# Altium project PMP1.PrjPcb
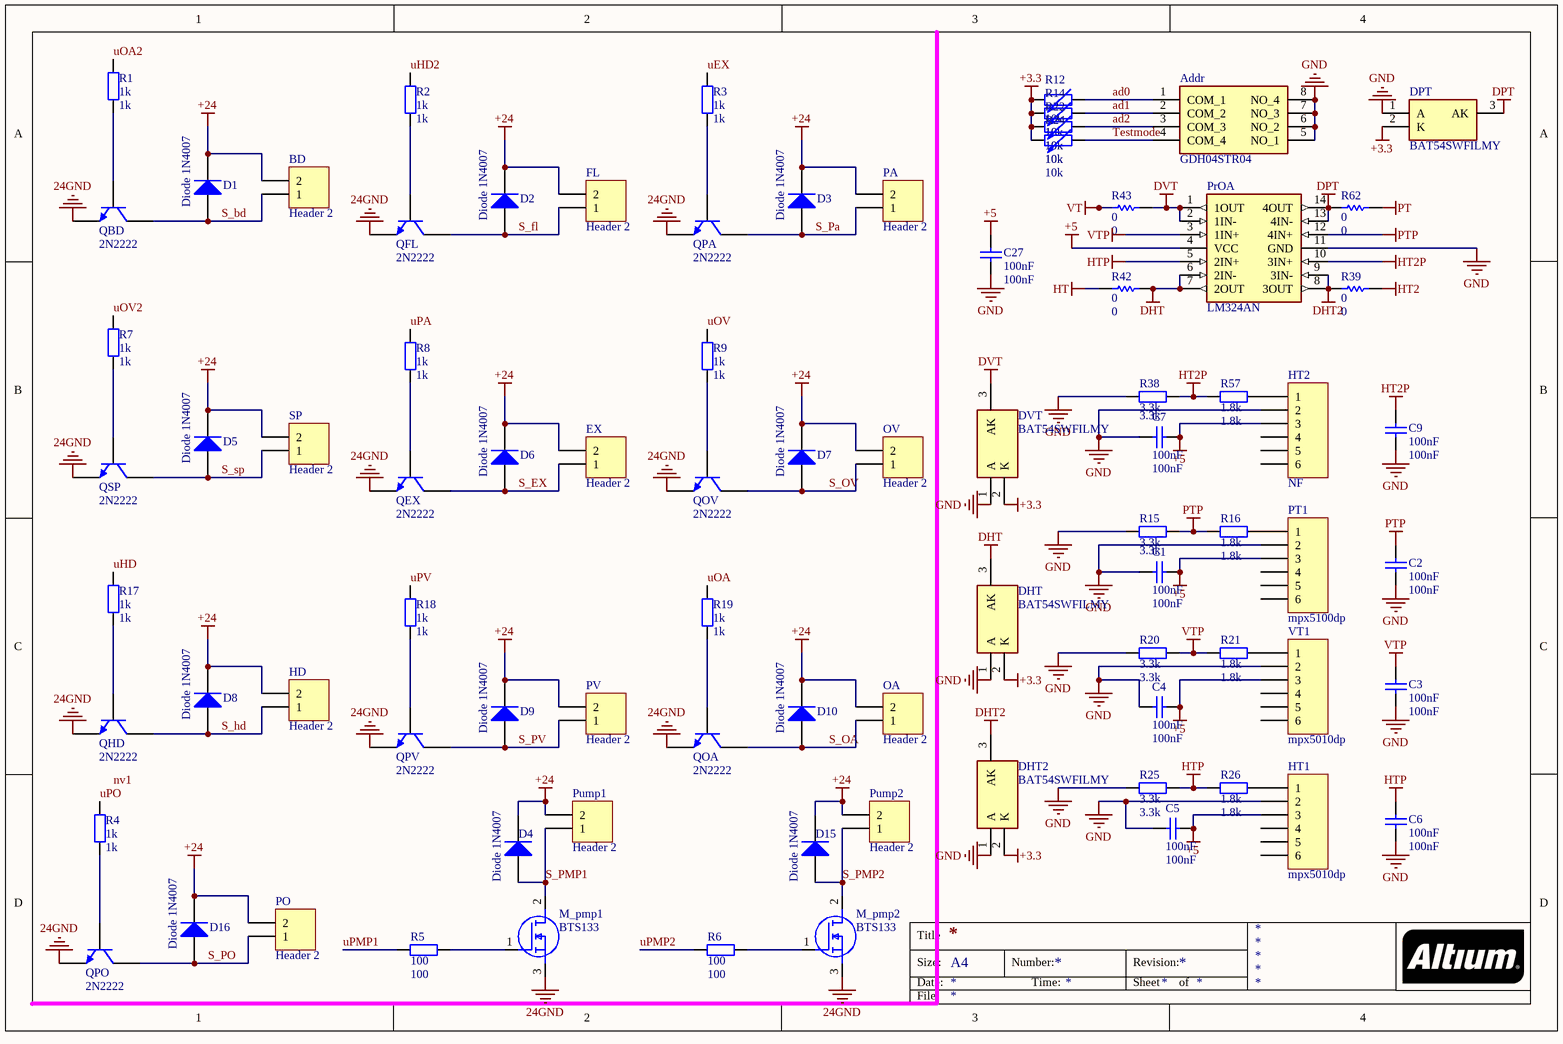
[diagram p0: accessories.SchDoc]
5 sheets, 198 parts. Net scope: global (net labels, ports and power ports of the same name join across sheets).
Board file: PMP.PcbDoc
Sheets:
  accessories.SchDoc
  Power.SchDoc
  microf4.SchDoc
  CAN bus.SchDoc
  gatedriver.SchDoc

## Sheet accessories.SchDoc
size A4

### Parts
Addr  GDH04STR04  [GDH04STR04]
BD  Header 2  [PHOENIX2-Right]
C1  100nF  [0805]
C2  100nF  [0805]
C3  100nF  [0805]
C4  100nF  [0805]
C5  100nF  [0805]
C6  100nF  [0805]
C7  100nF  [0805]
C9  100nF  [0805]
C27  100nF  [0805]
D1  Diode 1N4007  [DO-41]
D2  Diode 1N4007  [DO-41]
D3  Diode 1N4007  [DO-41]
D4  Diode 1N4007  [DO-41]
D5  Diode 1N4007  [DO-41]
D6  Diode 1N4007  [DO-41]
D7  Diode 1N4007  [DO-41]
D8  Diode 1N4007  [DO-41]
D9  Diode 1N4007  [DO-41]
D10  Diode 1N4007  [DO-41]
D15  Diode 1N4007  [DO-41]
D16  Diode 1N4007  [DO-41]
DHT  BAT54SWFILMY  [psm712]
DHT2  BAT54SWFILMY  [psm712]
DPT  BAT54SWFILMY  [psm712]
DVT  BAT54SWFILMY  [psm712]
EX  Header 2  [PHOENIX2-Right]
FL  Header 2  [PHOENIX2-Right]
HD  Header 2  [PHOENIX2-Right]
HT1  mpx5010dp  [mpx-dp]
HT2  NF  [mpx-dp]
M_pmp1  BTS133  [IPB026N06NATMA1]
M_pmp2  BTS133  [IPB026N06NATMA1]
OA  Header 2  [PHOENIX2-Right]
OV  Header 2  [PHOENIX2-Right]
PA  Header 2  [PHOENIX2-Right]
PO  Header 2  [PHOENIX2-right]
PrOA  LM324AN  [DIP254P762X432-14]
PT1  mpx5100dp  [mpx-dp]
Pump1  Header 2  [PHOENIX2-Right]
Pump2  Header 2  [PHOENIX2-Right]
PV  Header 2  [PHOENIX2-Right]
QBD  2N2222  [2n2222]
QEX  2N2222  [2n2222]
QFL  2N2222  [2n2222]
QHD  2N2222  [2n2222]
QOA  2N2222  [2n2222]
QOV  2N2222  [2n2222]
QPA  2N2222  [2n2222]
QPO  2N2222  [2n2222]
QPV  2N2222  [2n2222]
QSP  2N2222  [2n2222]
R1  1k  [0805]
R2  1k  [0805]
R3  1k  [0805]
R4  1k  [0805]
R5  100  [0805]
R6  100  [0805]
R7  1k  [0805]
R8  1k  [0805]
R9  1k  [0805]
R12  10k  [0805]
R14  10k  [0805]
R15  3.3k  [0805]
R16  1.8k  [0805]
R17  1k  [0805]
R18  1k  [0805]
R19  1k  [0805]
R20  3.3k  [0805]
R21  1.8k  [0805]
R22  10k  [0805]
R24  10k  [0805]
R25  3.3k  [0805]
R26  1.8k  [0805]
R38  3.3k  [0805]
R39  0  [0805]
R42  0  [0805]
R43  0  [0805]
R57  1.8k  [0805]
R62  0  [0805]
SP  Header 2  [PHOENIX2-Right]
VT1  mpx5010dp  [mpx-dp]

### Nets
24GND: M_pmp1.3(S) M_pmp2.3(S) QBD.1(E) QEX.1(E) QFL.1(E) QHD.1(E) QOA.1(E) QOV.1(E) QPA.1(E) QPO.1(E) QPV.1(E) QSP.1(E)
+3.3: DHT.2(K) DHT2.2(K) DPT.2(K) DVT.2(K) R12.2 R14.2 R22.2 R24.2
+5: C1.1 C4.1 C5.1 C7.1 C27.2 HT1.3 HT2.3 PrOA.4(VCC) PT1.3 VT1.3
+24: BD.2 D1.2(K) D2.2(K) D3.2(K) D4.2(K) D5.2(K) D6.2(K) D7.2(K) D8.2(K) D9.2(K) D10.2(K) D15.2(K) D16.2(K) EX.2 FL.2 HD.2 OA.2 OV.2 PA.2 PO.2 Pump1.2 Pump2.2 PV.2 SP.2
DHT: DHT.3(AK) PrOA.6(2IN-) PrOA.7(2OUT) R42.1
DHT2: DHT2.3(AK) PrOA.8(3OUT) PrOA.9(3IN-) R39.1
DPT: DPT.3(AK) PrOA.13(4IN-) PrOA.14(4OUT) R62.1
DVT: DVT.3(AK) PrOA.1(1OUT) PrOA.2(1IN-) R43.2
GND: Addr.5(NO_1) Addr.6(NO_2) Addr.7(NO_3) Addr.8(NO_4) C1.2 C2.2 C3.2 C4.2 C5.2 C6.2 C7.2 C9.2 C27.1 DHT.1(A) DHT2.1(A) DPT.1(A) DVT.1(A) HT1.2 HT2.2 PrOA.11(GND) PT1.2 R15.1 R20.1 R25.1 R38.1 VT1.2  [project net 5GND]
HT: R42.2
HT2: R39.2
HT2P: C9.1 PrOA.10(3IN+) R38.2 R57.1
HTP: C6.1 PrOA.5(2IN+) R25.2 R26.1
PT: R62.2
PTP: C2.1 PrOA.12(4IN+) R15.2 R16.1
VT: R43.1
VTP: C3.1 PrOA.3(1IN+) R20.2 R21.1
ad0: Addr.1(COM_1) R12.1
ad1: Addr.2(COM_2) R14.1
ad2: Addr.3(COM_3) R22.1
S_bd: BD.1 D1.1(A) QBD.3(C)
S_EX: D6.1(A) EX.1 QEX.3(C)
S_fl: D2.1(A) FL.1 QFL.3(C)
S_hd: D8.1(A) HD.1 QHD.3(C)
S_OA: D10.1(A) OA.1 QOA.3(C)
S_OV: D7.1(A) OV.1 QOV.3(C)
S_Pa: D3.1(A) PA.1 QPA.3(C)
S_PMP1: D4.1(A) M_pmp1.2(D) Pump1.1
S_PMP2: D15.1(A) M_pmp2.2(D) Pump2.1
S_PO: D16.1(A) PO.1 QPO.3(C)
S_PV: D9.1(A) PV.1 QPV.3(C)
S_sp: D5.1(A) QSP.3(C) SP.1
Testmode: Addr.4(COM_4) R24.1
uEX: R3.1
uHD: R17.1
uHD2: R2.1
uOA: R19.1
uOA2: R1.1
uOV: R9.1
uOV2: R7.1
uPA: R8.1
uPMP1: R5.1
uPMP2: R6.1
uPO: R4.1
uPV: R18.1
NetHT1_1: HT1.1 R26.2
NetHT2_1: HT2.1 R57.2
NetM_pmp1_1: M_pmp1.1(G) R5.2
NetM_pmp2_1: M_pmp2.1(G) R6.2
NetPT1_1: PT1.1 R16.2
NetQBD_2: QBD.2(B) R1.2
NetQEX_2: QEX.2(B) R8.2
NetQFL_2: QFL.2(B) R2.2
NetQHD_2: QHD.2(B) R17.2
NetQOA_2: QOA.2(B) R19.2
NetQOV_2: QOV.2(B) R9.2
NetQPA_2: QPA.2(B) R3.2
NetQPO_2: QPO.2(B) R4.2
NetQPV_2: QPV.2(B) R18.2
NetQSP_2: QSP.2(B) R7.2
NetR21_2: R21.2 VT1.1

Not connected (* = marked no-connect by the designer): HT1 4 5 6; HT2 4 5 6; PT1 4 5 6; VT1 4 5 6

### Notes on the sheet
- Labels drawn without touching a wire or pin: nv1
- Title
- Size:
- Date:
- A4
- Number:
- Time:
- Revision:
- Sheet
- of
- File:

### Library data of the parts
Addr = GDH04STR04: Switch; Manufacturer_Name: TE Connectivity; Datasheet Link: https://www.te.com/commerce/DocumentDelivery/DDEController?Action=showdoc&DocId=Customer+Drawing%7F1571983%7FC6%7Fpdf%7FEnglish%7FENG_CD_1571983_C6.pdf%7F1571983-5; Height: 2.31mm; Manufacturer_Part_Number: GDH04STR04; Mouser Part Number: 506-GDH04STR04; Mouser Price/Stock: https://www.mouser.co.uk/ProductDetail/TE-Connectivity-Alcoswitch/GDH04STR04?qs=k5V78Jg%2Feq61xymfueD9KA%3D%3D; Arrow Part Number: GDH04STR04; Arrow Price/Stock: https://www.arrow.com/en/products/gdh04str04/te-connectivity?region=nac
BD EX FL HD OA OV PA PO Pump1 Pump2 PV SP = Header 2: Header, 2-Pin; LatestRevisionDate: 17-Jul-2002; LatestRevisionNote: Re-released for DXP Platform.; Publisher: Altium Limited
C1-C7 C9 = Cap: Capacitor; Published: 8-Jun-2000; LatestRevisionDate: 17-Jul-2002; LatestRevisionNote: Re-released for DXP Platform.; PackageReference: RAD-0.3; Publisher: Altium Limited; PackageDescription: Radial Cap, Thru-Hole; 2 Leads; 0.3 in Pin Spacing; Value: 100nF
C27 = Cap: Capacitor; Manufacturer: Generic Components; Class: Passive; Published: 08/06/2000; Publisher: Altium Hobart Technology Centre; SubClass: Capacitor; Value: 100nF
D1-D10 D15 D16 = Diode 1N4007: 1 Amp General Purpose Rectifier; Published: 8-Jun-2000; LatestRevisionDate: 17-Jul-2002; LatestRevisionNote: Re-released for DXP Platform.; DatasheetVersion: 1998; PackageVersion: Aug-1999; PackageReference: DO-41; Publisher: Altium Limited; PackageDescription: Diode, Axial; Body 5.2 x 2.7 mm (LxDia. max), Lead Dia. 0.86 mm (max); Code_JEDEC: DO-204-AL; ComponentLink1Description: Manufacturer Link; ComponentLink1URL: http://www.fairchildsemi.com/; ComponentLink2Description: Datasheet; ComponentLink2URL: http://www.fairchildsemi.com/ds/1N%2F1N4001.pdf
DHT DHT2 DPT DVT = BAT54SWFILMY: Schottky Diode; Manufacturer_Name: STMicroelectronics; Datasheet Link: https://www.st.com/resource/en/datasheet/cd00001322.pdf; Height: 1.1mm; Manufacturer_Part_Number: BAT54SWFILMY; Mouser Part Number: 511-BAT54SWFILMY; Mouser Price/Stock: https://www.mouser.co.uk/ProductDetail/STMicroelectronics/BAT54SWFILMY?qs=j%252B1pi9TdxUbxN4fraErVag%3D%3D; Arrow Part Number: BAT54SWFILMY; Arrow Price/Stock: https://www.arrow.com/en/products/bat54swfilmy/stmicroelectronics?region=europe
HT1 HT2 PT1 VT1 = Header 6: Header, 6-Pin; LatestRevisionDate: 17-Jul-2002; LatestRevisionNote: Re-released for DXP Platform.; Publisher: Altium Limited
M_pmp1 M_pmp2 = IPB026N06NATMA1: MOSFET (N-Channel); Manufacturer_Name: Infineon; Datasheet Link: https://www.infineon.com/dgdl/IPB026N06N_Rev2.0.pdf?folderId=db3a304313b8b5a60113cee8763b02d7&fileId=db3a3043372d5cc8013754c7b2a74f7c; Height: 4.82mm; Manufacturer_Part_Number: IPB026N06NATMA1; Mouser Part Number: 726-IPB026N06NATMA1; Mouser Price/Stock: https://www.mouser.co.uk/ProductDetail/Infineon-Technologies/IPB026N06NATMA1?qs=4MqXaUMeF56mbQMXMhITXA%3D%3D; Arrow Part Number: IPB026N06NATMA1; Arrow Price/Stock: https://www.arrow.com/en/products/ipb026n06natma1/infineon-technologies-ag
PrOA = LM324AN: Integrated Circuit; Manufacturer_Name: Texas Instruments; Datasheet Link: http://www.ti.com/lit/ds/symlink/lm324a.pdf; Height: 5.08mm; Manufacturer_Part_Number: LM324AN; Mouser Part Number: 595-LM324AN; Mouser Price/Stock: https://www.mouser.com/Search/Refine.aspx?Keyword=595-LM324AN; RS Part Number: 0527732; RS Price/Stock: http://uk.rs-online.com/web/p/products/0527732
QBD QEX QFL QHD QOA QOV QPA QPO QPV QSP = 2N3904: NPN General Purpose Amplifier; Published: 8-Jun-2000; LatestRevisionDate: 15-Jan-2003; LatestRevisionNote: PCB Footprint 'BCY-W3/D4.7' replaced; DatasheetVersion: 1997; PackageVersion: Sep-1998; PackageReference: TO-92A; Publisher: Altium Limited; PackageDescription: TO, Flat Index; 3 In-Line, Axial Leads; Body Dia. 4.5mm; Leads 0.51 x 0.48 mm (max); ComponentLink1Description: Manufacturer Link; ComponentLink1URL: http://www.fairchildsemi.com/; ComponentLink2Description: Datasheet; ComponentLink2URL: http://www.fairchildsemi.com/ds/2N%2F2N3904.pdf
R1-R9 R15-R21 R25 R26 R38 R57 = Res2: Resistor; Published: 8-Jun-2000; LatestRevisionDate: 17-Jul-2002; LatestRevisionNote: Re-released for DXP Platform.; PackageReference: AXIAL-0.4; Publisher: Altium Limited; PackageDescription: Axial Device, Thru-Hole; 2 Leads; 0.4 in Pin Spacing
  R1-R4 R7-R9 R17-R19: Value: 1k
  R5 R6: Value: 100
  R15 R20 R25 R38: Value: 3.3k
  R16 R21 R26 R57: Value: 1.8k
R12 R14 R22 R24 = Res Adj2: Variable Resistor; Set Position: 0.5; Published: 8-Jun-2000; LatestRevisionDate: 17-Jul-2002; LatestRevisionNote: Re-released for DXP Platform.; PackageReference: AXIAL-0.6; Publisher: Altium Limited; PackageDescription: Axial Device, Thru-Hole; 2 Leads; 0.6 in Pin Spacing; Value: 10k
R39 R42 R43 R62 = Res1: Resistor; Published: 8-Jun-2000; LatestRevisionDate: 17-Jul-2002; LatestRevisionNote: Re-released for DXP Platform.; PackageReference: AXIAL-0.3; Publisher: Altium Limited; Value: 0

## Sheet Power.SchDoc
size A4
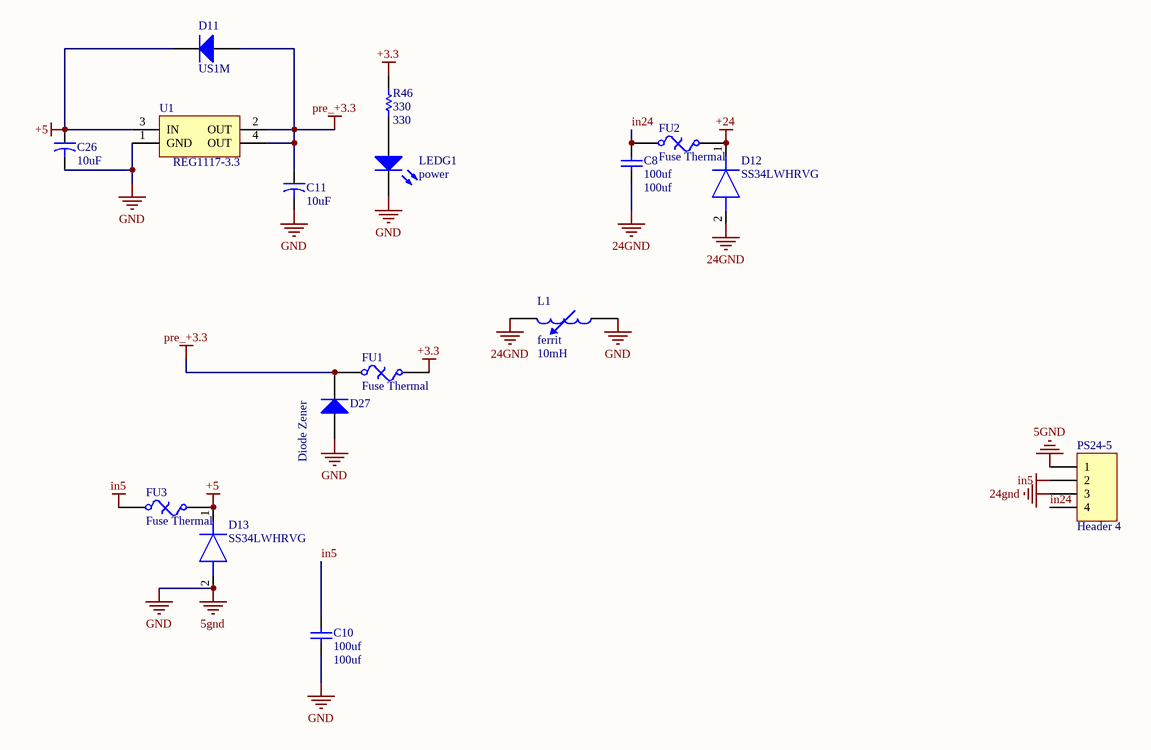
[diagram p1: Power.SchDoc]

### Parts
C8  100uf  [HDR1X2]
C10  100uf  [HDR1X2]
C11  10uF  [0805]
C26  10uF  [0805]
D11  US1M  [US1M]
D12  SS34LWHRVG  [SS34]
D13  SS34LWHRVG  [SS34]
D27  Diode Zener  [d1805]
FU1  Fuse Thermal  [1206]
FU2  Fuse Thermal  [resetable fuse 3A]
FU3  Fuse Thermal  [1206]
L1  ferrit  value 10mH  [fBEAD]
LEDG1  power  [3518]
PS24-5  Header 4  [phoenix4-right]
R46  330  [0805]
U1  REG1117-3.3  [SOT223]

### Nets
5GND: C10.1 C11.2 C26.2 D13.2(A) D27.1(A) L1.1 LEDG1.2(K) PS24-5.1 U1.1(GND)  [also labelled GND]
24GND: C8.1 D12.2(A) L1.2 PS24-5.3
+3.3: FU1.2 R46.1
+5: C26.1 D11.2(K) D13.1(K) FU3.2 U1.3(IN)
+24: D12.1(K) FU2.2
in5: C10.2 FU3.1 PS24-5.2
pre_+3.3: C11.1 D11.1(A) D27.2(K) FU1.1 U1.2(OUT) U1.4(OUT)
in24: C8.2 FU2.1 PS24-5.4
NetLEDG1_1: LEDG1.1(A) R46.2

### Library data of the parts
C8 C10 = Cap: Capacitor; Published: 8-Jun-2000; LatestRevisionDate: 17-Jul-2002; LatestRevisionNote: Re-released for DXP Platform.; PackageReference: RAD-0.3; Publisher: Altium Limited; PackageDescription: Radial Cap, Thru-Hole; 2 Leads; 0.3 in Pin Spacing; Value: 100uf
C11 C26 = Cap_El: Capacitor; Published: 23-Sep-2002; PackageReference: CAPR5-4X5; Publisher: Altium Limited; Value: 10uF
D11 = Diode: 1 Amp General Purpose Rectifier; Revision 1: 11-Jul-2000: SIM Model Added.; Revision 2: 17-Jul-2002: Re-released for DXP Platform.; Package Information: Latest Revision: Aug-1999; Code - JEDEC: DO-204-AL; Published: 8-Jun-2000; Datasheet: Latest Revision: 1998; Package Reference: DO-41; Publisher: Altium Limited
D12 D13 = SS34LWHRVG: Diode; Manufacturer_Name: Taiwan Semiconductor; Datasheet Link: https://datasheet.datasheetarchive.com/originals/distributors/DKDS-20/389381.pdf; Height: 1.02mm; Manufacturer_Part_Number: SS34LWHRVG; Mouser Part Number: 821-SS34LWHRVG; Mouser Price/Stock: https://www.mouser.co.uk/ProductDetail/Taiwan-Semiconductor/SS34LWHRVG?qs=5aG0NVq1C4zYvYQjFNyRbA%3D%3D; Arrow Part Number: SS34LWHRVG; Arrow Price/Stock: https://www.arrow.com/en/products/ss34lwhrvg/taiwan-semiconductor?region=asia
D27 = Diode 1N914: High Conductance Fast Diode; Published: 8-Jun-2000; LatestRevisionDate: 17-Jul-2002; LatestRevisionNote: Re-released for DXP Platform.; DatasheetVersion: 1997; PackageReference: DO-35; Publisher: Altium Limited; PackageDescription: Diode, Axial; Body 3.8 x 1.9 mm (LxDia. max), Lead Dia. 0.53 mm (max); Code_JEDEC: DO-204-AH; ComponentLink1Description: Manufacturer Link; ComponentLink1URL: http://www.fairchildsemi.com/; ComponentLink2Description: Datasheet; ComponentLink2URL: http://www.fairchildsemi.com/ds/1N%2F1N4448.pdf
FU1-FU3 = Fuse Thermal: Thermal Fuse; Published: 24-Mar-1999; LatestRevisionDate: 17-Jul-2002; LatestRevisionNote: Re-released for DXP Platform.; PackageReference: PIN-W2/E2.8; Publisher: Altium Limited; PackageDescription: Thru-Hole; 2 Leads
L1 = Inductor Adj: Adjustable Inductor; Set Position: 0.5; Published: 24-Mar-1999; LatestRevisionDate: 17-Jul-2002; LatestRevisionNote: Re-released for DXP Platform.; PackageReference: AXIAL-0.8; Publisher: Altium Limited; PackageDescription: Axial Device, Thru-Hole; 2 Leads; 0.8 in Pin Spacing
LEDG1 = LED3: Typical BLUE SiC LED; pin to pad: 1>2 2>1; Published: 8-Jun-2000; LatestRevisionDate: 17-Dec-2003; LatestRevisionNote: PCB Footprint replaced.; DatasheetDocument: 16-Apr-2002; PackageDocument: 16-Apr-2002; PackageReference: 3.5X2.8X1.9; Publisher: Altium Limited
PS24-5 = Header 4: Header, 4-Pin; LatestRevisionDate: 17-Jul-2002; LatestRevisionNote: Re-released for DXP Platform.; Publisher: Altium Limited
R46 = Res1: Resistor; Published: 8-Jun-2000; LatestRevisionDate: 17-Jul-2002; LatestRevisionNote: Re-released for DXP Platform.; PackageReference: AXIAL-0.3; Publisher: Altium Limited; Value: 330
U1 = REG1117-3.3: 800mA and 1A Low Dropout Positive Regulator 2.85V, 3.3V, 5V, and Adjustable; Published: 8-Jun-2000; LatestRevisionDate: 17-Jul-2002; LatestRevisionNote: Re-released for DXP Platform.; DatasheetVersion: Sep-1997; PackageVersion: revC; PackageReference: ZZ311; Publisher: Altium Limited; PackageDescription: SOT-223/SC-73; 4 Leads; Body 6.7 x 7.3 mm, inc. leads (LxW max); ComponentLink1Description: Manufacturer Link; ComponentLink1URL: http://www.ti.com/; ComponentLink2Description: Datasheet; ComponentLink2URL: http://www-s.ti.com/sc/ds/REG1117.pdf

## Sheet microf4.SchDoc
size A2
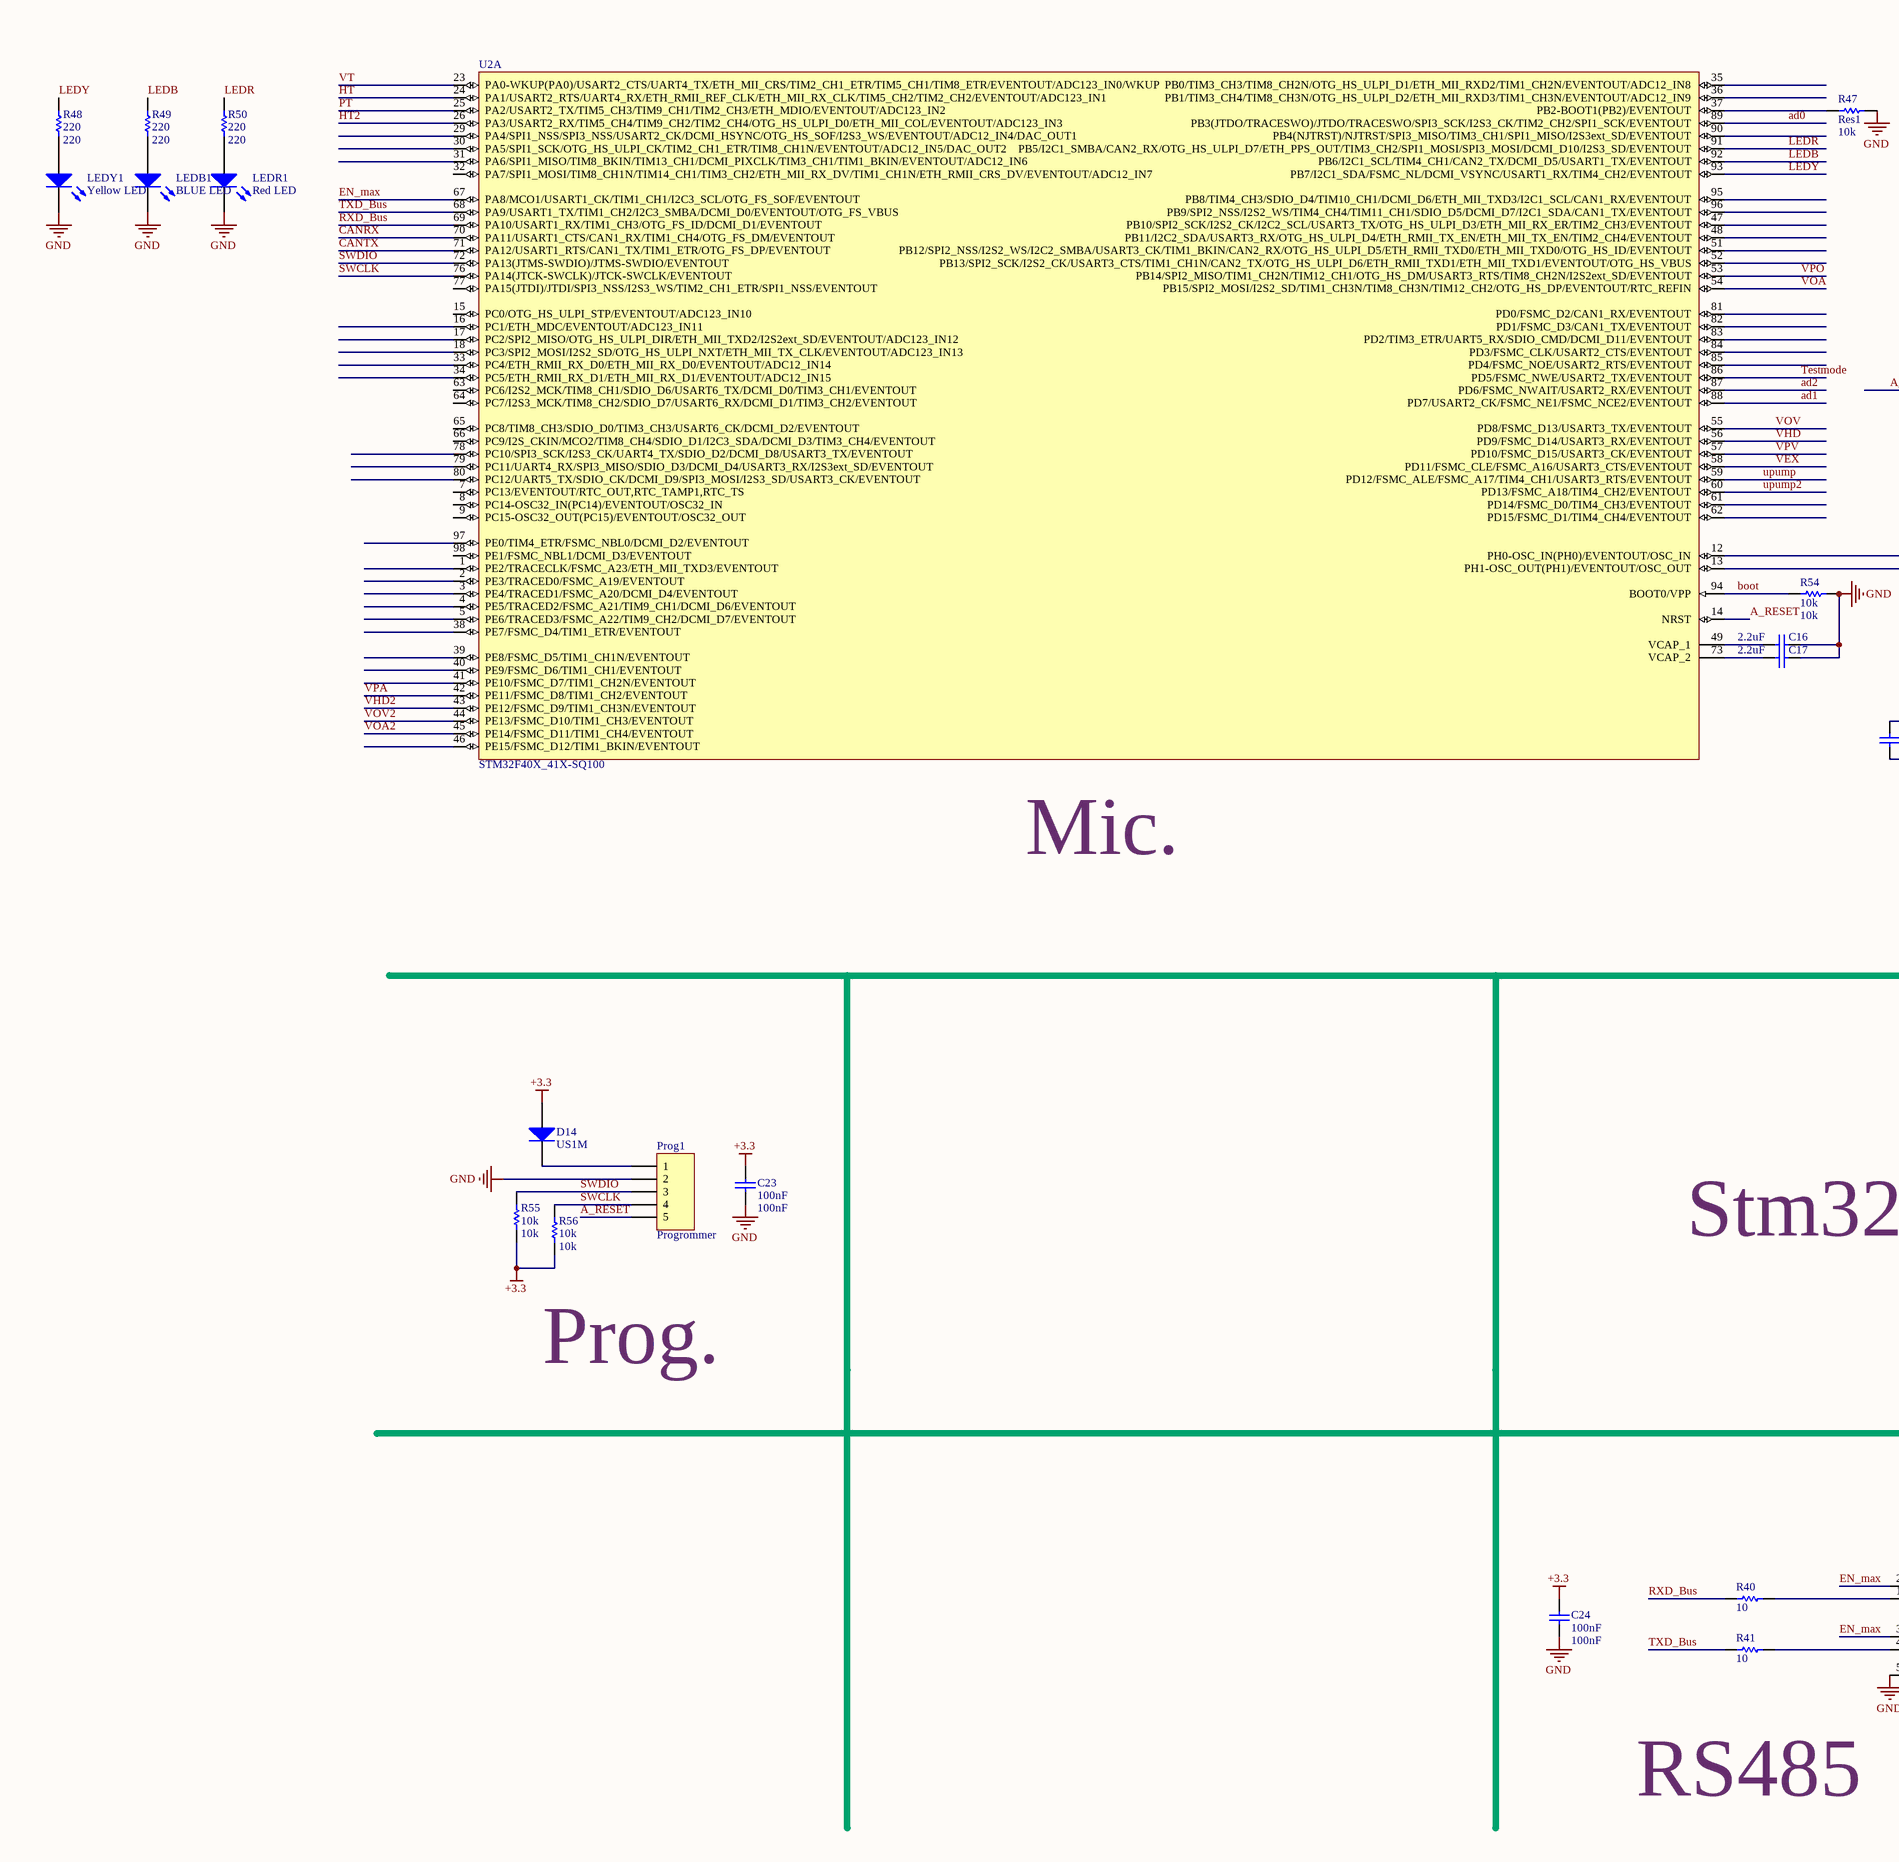
[diagram p2: microf4.SchDoc, left]
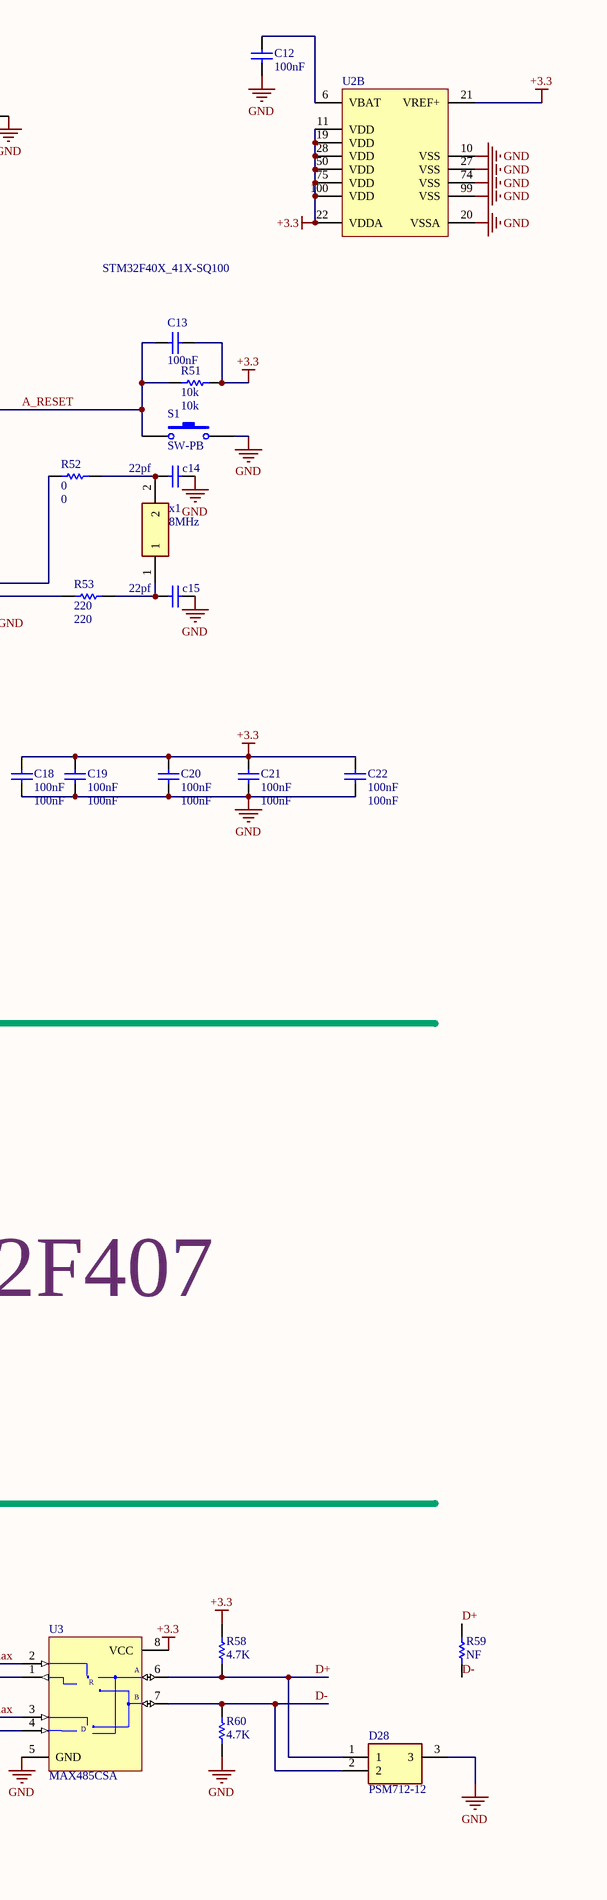
[diagram p3: microf4.SchDoc, right]

### Parts
C12  100nF  [0805]
C13  value 100nF  [0805]
c14  22pf  [0805]
c15  22pf  [0805]
C16  2.2uF  [0805]
C17  2.2uF  [0805]
C18  100nF  [0805]
C19  100nF  [0805]
C20  100nF  [0805]
C21  100nF  [0805]
C22  100nF  [0805]
C23  100nF  [0805]
C24  100nF  [0805]
D14  US1M  [US1M]
D28  PSM712-12  [psm712]
LEDB1  BLUE LED  [3518]
LEDR1  Red LED  [3518]
LEDY1  Yellow LED  [3518]
Prog1  Progrommer  [jp circular 5]
R40  10  [0805]
R41  10  [0805]
R47  Res1  value 10k  [0805]
R48  220  [0805]
R49  220  [0805]
R50  220  [0805]
R51  10k  [0805]
R52  0  [0805]
R53  220  [0805]
R54  10k  [0805]
R55  10k  [0805]
R56  10k  [0805]
R58  4.7K  [0805]
R59  NF  [0805]
R60  4.7K  [0805]
S1  SW-PB  [sw-pb-4p]
U2  STM32F40X_41X-SQ100  [100A_N]  (parts A,B of 2)
U3  MAX485CSA  [NSO8_N]
x1  8MHz  [HC49/4HSMX_1]

### Nets
+3.3: C13.1 C18.2 C19.2 C20.2 C21.2 C22.2 C23.2 C24.2 D14.1(A) R51.2 R55.2 R56.2 R58.1 U2.11(VDD) U2.19(VDD) U2.21(VREF+) U2.22(VDDA) U2.28(VDD) U2.50(VDD) U2.75(VDD) U2.100(VDD) U3.8(VCC)
GND: C12.1 c14.2 c15.2 C16.2 C17.2 C18.1 C19.1 C20.1 C21.1 C22.1 C23.1 C24.1 D28.3 LEDB1.2(K) LEDR1.2(K) LEDY1.2(K) Prog1.2 R47.2 R54.2 R60.2 S1.2 U2.10(VSS) U2.20(VSSA) U2.27(VSS) U2.74(VSS) U2.99(VSS) U3.5(GND)  [project net 5GND]
HT: U2.24(PA1/USART2_RTS/UART4_RX/ETH_RMII_REF_CLK/ETH_MII_RX_CLK/TIM5_CH2/TIM2_CH2/EVENTOUT/ADC123_IN1)
HT2: U2.26(PA3/USART2_RX/TIM5_CH4/TIM9_CH2/TIM2_CH4/OTG_HS_ULPI_D0/ETH_MII_COL/EVENTOUT/ADC123_IN3)
PT: U2.25(PA2/USART2_TX/TIM5_CH3/TIM9_CH1/TIM2_CH3/ETH_MDIO/EVENTOUT/ADC123_IN2)
VT: U2.23(PA0-WKUP(PA0)/USART2_CTS/UART4_TX/ETH_MII_CRS/TIM2_CH1_ETR/TIM5_CH1/TIM8_ETR/EVENTOUT/ADC123_IN0/WKUP)
A_RESET: C13.2 Prog1.5 R51.1 S1.1 U2.14(NRST)
ad0: U2.89(PB3(JTDO/TRACESWO)/JTDO/TRACESWO/SPI3_SCK/I2S3_CK/TIM2_CH2/SPI1_SCK/EVENTOUT)
ad1: U2.88(PD7/USART2_CK/FSMC_NE1/FSMC_NCE2/EVENTOUT)
ad2: U2.87(PD6/FSMC_NWAIT/USART2_RX/EVENTOUT)
boot: R54.1 U2.94(BOOT0/VPP)
CANRX: U2.70(PA11/USART1_CTS/CAN1_RX/TIM1_CH4/OTG_FS_DM/EVENTOUT)
CANTX: U2.71(PA12/USART1_RTS/CAN1_TX/TIM1_ETR/OTG_FS_DP/EVENTOUT)
D+: D28.1 R58.2 R59.1 U3.6(A)
D-: D28.2 R59.2 R60.1 U3.7(B)
EN_max: U2.67(PA8/MCO1/USART1_CK/TIM1_CH1/I2C3_SCL/OTG_FS_SOF/EVENTOUT) U3.2(~{RE}) U3.3(DE)
LEDB: R49.1 U2.92(PB6/I2C1_SCL/TIM4_CH1/CAN2_TX/DCMI_D5/USART1_TX/EVENTOUT)
LEDR: R50.1 U2.91(PB5/I2C1_SMBA/CAN2_RX/OTG_HS_ULPI_D7/ETH_PPS_OUT/TIM3_CH2/SPI1_MOSI/SPI3_MOSI/DCMI_D10/I2S3_SD/EVENTOUT)
LEDY: R48.1 U2.93(PB7/I2C1_SDA/FSMC_NL/DCMI_VSYNC/USART1_RX/TIM4_CH2/EVENTOUT)
RXD_Bus: R40.2 U2.69(PA10/USART1_RX/TIM1_CH3/OTG_FS_ID/DCMI_D1/EVENTOUT)
SWCLK: Prog1.4 R56.1 U2.76(PA14(JTCK-SWCLK)/JTCK-SWCLK/EVENTOUT)
SWDIO: Prog1.3 R55.1 U2.72(PA13(JTMS-SWDIO)/JTMS-SWDIO/EVENTOUT)
Testmode: U2.86(PD5/FSMC_NWE/USART2_TX/EVENTOUT)
TXD_Bus: R41.2 U2.68(PA9/USART1_TX/TIM1_CH2/I2C3_SMBA/DCMI_D0/EVENTOUT/OTG_FS_VBUS)
upump: U2.59(PD12/FSMC_ALE/FSMC_A17/TIM4_CH1/USART3_RTS/EVENTOUT)
upump2: U2.60(PD13/FSMC_A18/TIM4_CH2/EVENTOUT)
VEX: U2.58(PD11/FSMC_CLE/FSMC_A16/USART3_CTS/EVENTOUT)
VHD: U2.56(PD9/FSMC_D14/USART3_RX/EVENTOUT)
VHD2: U2.43(PE12/FSMC_D9/TIM1_CH3N/EVENTOUT)
VOA: U2.54(PB15/SPI2_MOSI/I2S2_SD/TIM1_CH3N/TIM8_CH3N/TIM12_CH2/OTG_HS_DP/EVENTOUT/RTC_REFIN)
VOA2: U2.45(PE14/FSMC_D11/TIM1_CH4/EVENTOUT)
VOV: U2.55(PD8/FSMC_D13/USART3_TX/EVENTOUT)
VOV2: U2.44(PE13/FSMC_D10/TIM1_CH3/EVENTOUT)
VPA: U2.42(PE11/FSMC_D8/TIM1_CH2/EVENTOUT)
VPO: U2.53(PB14/SPI2_MISO/TIM1_CH2N/TIM12_CH1/OTG_HS_DM/USART3_RTS/TIM8_CH2N/I2S2ext_SD/EVENTOUT)
VPV: U2.57(PD10/FSMC_D15/USART3_CK/EVENTOUT)
NetC12_2: C12.2 U2.6(VBAT)
Netc14_1: c14.1 R52.2 x1.2
Netc15_1: c15.1 R53.1 x1.1
NetC16_1: C16.1 U2.49(VCAP_1)
NetC17_1: C17.1 U2.73(VCAP_2)
NetD14_2: D14.2(K) Prog1.1
NetLEDB1_1: LEDB1.1(A) R49.2
NetLEDR1_1: LEDR1.1(A) R50.2
NetLEDY1_1: LEDY1.1(A) R48.2
NetR40_1: R40.1 U3.1(RO)
NetR41_1: R41.1 U3.4(DI)
NetR47_1: R47.1 U2.37(PB2-BOOT1(PB2)/EVENTOUT)
NetR52_1: R52.1 U2.12(PH0-OSC_IN(PH0)/EVENTOUT/OSC_IN)
NetR53_2: R53.2 U2.13(PH1-OSC_OUT(PH1)/EVENTOUT/OSC_OUT)

Not connected (* = marked no-connect by the designer): U2 1(PE2/TRACECLK/FSMC_A23/ETH_MII_TXD3/EVENTOUT) 2(PE3/TRACED0/FSMC_A19/EVENTOUT) 3(PE4/TRACED1/FSMC_A20/DCMI_D4/EVENTOUT) 4(PE5/TRACED2/FSMC_A21/TIM9_CH1/DCMI_D6/EVENTOUT) 5(PE6/TRACED3/FSMC_A22/TIM9_CH2/DCMI_D7/EVENTOUT) 7(PC13/EVENTOUT/RTC_OUT,RTC_TAMP1,RTC_TS) 8(PC14-OSC32_IN(PC14)/EVENTOUT/OSC32_IN) 9(PC15-OSC32_OUT(PC15)/EVENTOUT/OSC32_OUT) 15(PC0/OTG_HS_ULPI_STP/EVENTOUT/ADC123_IN10) 16(PC1/ETH_MDC/EVENTOUT/ADC123_IN11) 17(PC2/SPI2_MISO/OTG_HS_ULPI_DIR/ETH_MII_TXD2/I2S2ext_SD/EVENTOUT/ADC123_IN12) 18(PC3/SPI2_MOSI/I2S2_SD/OTG_HS_ULPI_NXT/ETH_MII_TX_CLK/EVENTOUT/ADC123_IN13) 29(PA4/SPI1_NSS/SPI3_NSS/USART2_CK/DCMI_HSYNC/OTG_HS_SOF/I2S3_WS/EVENTOUT/ADC12_IN4/DAC_OUT1) 30(PA5/SPI1_SCK/OTG_HS_ULPI_CK/TIM2_CH1_ETR/TIM8_CH1N/EVENTOUT/ADC12_IN5/DAC_OUT2) 31(PA6/SPI1_MISO/TIM8_BKIN/TIM13_CH1/DCMI_PIXCLK/TIM3_CH1/TIM1_BKIN/EVENTOUT/ADC12_IN6) 32(PA7/SPI1_MOSI/TIM8_CH1N/TIM14_CH1/TIM3_CH2/ETH_MII_RX_DV/TIM1_CH1N/ETH_RMII_CRS_DV/EVENTOUT/ADC12_IN7) 33(PC4/ETH_RMII_RX_D0/ETH_MII_RX_D0/EVENTOUT/ADC12_IN14) 34(PC5/ETH_RMII_RX_D1/ETH_MII_RX_D1/EVENTOUT/ADC12_IN15) 35(PB0/TIM3_CH3/TIM8_CH2N/OTG_HS_ULPI_D1/ETH_MII_RXD2/TIM1_CH2N/EVENTOUT/ADC12_IN8) 36(PB1/TIM3_CH4/TIM8_CH3N/OTG_HS_ULPI_D2/ETH_MII_RXD3/TIM1_CH3N/EVENTOUT/ADC12_IN9) 38(PE7/FSMC_D4/TIM1_ETR/EVENTOUT) 39(PE8/FSMC_D5/TIM1_CH1N/EVENTOUT) 40(PE9/FSMC_D6/TIM1_CH1/EVENTOUT) 41(PE10/FSMC_D7/TIM1_CH2N/EVENTOUT) 46(PE15/FSMC_D12/TIM1_BKIN/EVENTOUT) 47(PB10/SPI2_SCK/I2S2_CK/I2C2_SCL/USART3_TX/OTG_HS_ULPI_D3/ETH_MII_RX_ER/TIM2_CH3/EVENTOUT) 48(PB11/I2C2_SDA/USART3_RX/OTG_HS_ULPI_D4/ETH_RMII_TX_EN/ETH_MII_TX_EN/TIM2_CH4/EVENTOUT) 51(PB12/SPI2_NSS/I2S2_WS/I2C2_SMBA/USART3_CK/TIM1_BKIN/CAN2_RX/OTG_HS_ULPI_D5/ETH_RMII_TXD0/ETH_MII_TXD0/OTG_HS_ID/EVENTOUT) 52(PB13/SPI2_SCK/I2S2_CK/USART3_CTS/TIM1_CH1N/CAN2_TX/OTG_HS_ULPI_D6/ETH_RMII_TXD1/ETH_MII_TXD1/EVENTOUT/OTG_HS_VBUS) 61(PD14/FSMC_D0/TIM4_CH3/EVENTOUT) 62(PD15/FSMC_D1/TIM4_CH4/EVENTOUT) 63(PC6/I2S2_MCK/TIM8_CH1/SDIO_D6/USART6_TX/DCMI_D0/TIM3_CH1/EVENTOUT) 64(PC7/I2S3_MCK/TIM8_CH2/SDIO_D7/USART6_RX/DCMI_D1/TIM3_CH2/EVENTOUT) 65(PC8/TIM8_CH3/SDIO_D0/TIM3_CH3/USART6_CK/DCMI_D2/EVENTOUT) 66(PC9/I2S_CKIN/MCO2/TIM8_CH4/SDIO_D1/I2C3_SDA/DCMI_D3/TIM3_CH4/EVENTOUT) 77(PA15(JTDI)/JTDI/SPI3_NSS/I2S3_WS/TIM2_CH1_ETR/SPI1_NSS/EVENTOUT) 78(PC10/SPI3_SCK/I2S3_CK/UART4_TX/SDIO_D2/DCMI_D8/USART3_TX/EVENTOUT) 79(PC11/UART4_RX/SPI3_MISO/SDIO_D3/DCMI_D4/USART3_RX/I2S3ext_SD/EVENTOUT) 80(PC12/UART5_TX/SDIO_CK/DCMI_D9/SPI3_MOSI/I2S3_SD/USART3_CK/EVENTOUT) 81(PD0/FSMC_D2/CAN1_RX/EVENTOUT) 82(PD1/FSMC_D3/CAN1_TX/EVENTOUT) 83(PD2/TIM3_ETR/UART5_RX/SDIO_CMD/DCMI_D11/EVENTOUT) 84(PD3/FSMC_CLK/USART2_CTS/EVENTOUT) 85(PD4/FSMC_NOE/USART2_RTS/EVENTOUT) 90(PB4(NJTRST)/NJTRST/SPI3_MISO/TIM3_CH1/SPI1_MISO/I2S3ext_SD/EVENTOUT) 95(PB8/TIM4_CH3/SDIO_D4/TIM10_CH1/DCMI_D6/ETH_MII_TXD3/I2C1_SCL/CAN1_RX/EVENTOUT) 96(PB9/SPI2_NSS/I2S2_WS/TIM4_CH4/TIM11_CH1/SDIO_D5/DCMI_D7/I2C1_SDA/CAN1_TX/EVENTOUT) 97(PE0/TIM4_ETR/FSMC_NBL0/DCMI_D2/EVENTOUT) 98(PE1/FSMC_NBL1/DCMI_D3/EVENTOUT)

### Notes on the sheet
- (near U2) Mic.
- Stm32F407
- Prog.
- RS485
- (in symbol MAX485CSA) R; D

### Library data of the parts
C12 C24 = Cap: Capacitor; Published: 8-Jun-2000; LatestRevisionDate: 17-Jul-2002; LatestRevisionNote: Re-released for DXP Platform.; PackageReference: RAD-0.3; Publisher: Altium Limited; Value: 100nF
C13 C18-C23 = Cap: as C27 on sheet accessories; Published: 08/06/2000; Publisher: Altium Hobart Technology Centre; SubClass: Capacitor
  C18-C23: Value: 100nF
c14 c15 C16 C17 = Cap_UP: Capacitor; Published: 8-Jun-2000; LatestRevisionDate: 17-Jul-2002; LatestRevisionNote: Re-released for DXP Platform.; PackageReference: RAD-0.3; Publisher: Altium Limited
  c14 c15: Value: 22pf
  C16 C17: Value: 2.2uF
D14 = Diode: as D11 on sheet Power; Published: 8-Jun-2000; Datasheet: Latest Revision: 1998; Package Reference: DO-41; Publisher: Altium Limited
D28 = PSM712-12: TVS Diode (Bi-directional); Manufacturer_Name: ProTek Devices; Datasheet Link: http://www.protekdevices.com/xyz/documents/datasheets/psm712.pdf; Height: 1.21mm; Manufacturer_Part_Number: PSM712-12
LEDB1 LEDR1 LEDY1 = LED3: Typical BLUE SiC LED; pin to pad: 1>2 2>1; Published: 8-Jun-2000; LatestRevisionDate: 17-Dec-2003; LatestRevisionNote: PCB Footprint replaced.; DatasheetDocument: 16-Apr-2002; PackageDocument: 16-Apr-2002; PackageReference: 3.5X2.8X1.9; Publisher: Altium Limited
Prog1 = Header 5: Header, 5-Pin; LatestRevisionDate: 17-Jul-2002; LatestRevisionNote: Re-released for DXP Platform.; Publisher: Altium Limited
R40 R41 R47-R54 R58-R60 = Res1: Resistor; Published: 8-Jun-2000; LatestRevisionDate: 17-Jul-2002; LatestRevisionNote: Re-released for DXP Platform.; PackageReference: AXIAL-0.3; Publisher: Altium Limited
  R40 R41: Value: 10
  R48-R50 R53: Value: 220
  R51 R54: Value: 10k
  R52: Value: 0
  R58 R60: Value: 4.7K
  R59: Value: NF
R55 R56 = Res: Semiconductor Resistor; Published: 8-Jun-2000; LatestRevisionDate: 17-Jul-2002; LatestRevisionNote: Re-released for DXP Platform.; PackageReference: AXIAL-0.5; Publisher: Altium Limited; Value: 10k
S1 = SW-PB: Switch; Published: 24-Mar-1999; LatestRevisionDate: 17-Jul-2002; LatestRevisionNote: Re-released for DXP Platform.; PackageReference: SPST-2; Publisher: Altium Limited
U3 = MAX485CSA: Low-Power, Slew-Rate-Limited RS-485/RS-422 Transceiver; Published: 16-Jan-2001; LatestRevisionDate: 13-Apr-2006; LatestRevisionNote: IPC-7351 Footprint Added.; DatasheetVersion: Feb-1996; PackageReference: NSO8; Publisher: Altium Limited; PackageDescription: 8-Pin Small Outline Integrated Circuit 1.27 mm Pitch; Code_JEDEC: MS-012-AA; Code_IPC: SOIC127P600-8; ComponentLink1Description: Manufacturer Link; ComponentLink1URL: http://www.maxim-ic.com/; ComponentLink2Description: Datasheet; ComponentLink2URL: http://pdfserv.maxim-ic.com/en/ds/MAX1487-MAX491.pdf
x1 = 20.0MHz_HC49_4HSMX_30_50_-40+85C_30pF: Crystal or Oscillator; Manufacturer_Name: IQD; Manufacturer_Part_Number: 20.0MHz HC49/4HSMX 30/50/-40+85°C/30pF; Datasheet Link: http://docs-emea.rs-online.com/webdocs/12fa/0900766b812fa555.pdf

## Sheet CAN bus.SchDoc
size A2
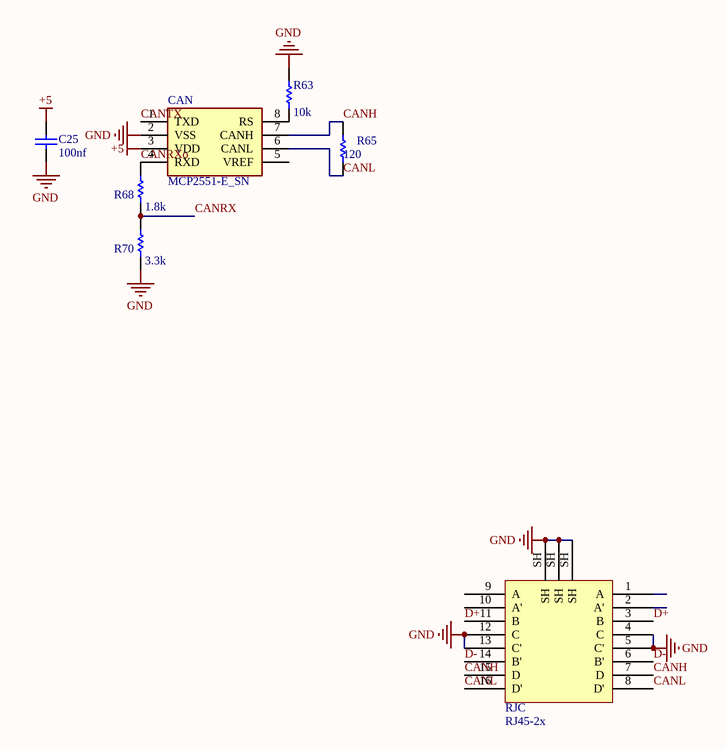
[diagram p4: CAN bus.SchDoc]

### Parts
C25  100nf  [0805]
CAN  MCP2551-E_SN  [SOIC127P600X175-8N]
R63  value 10k  [0805]
R65  value 120  [0805]
R68  value 1.8k  [0805]
R70  value 3.3k  [0805]
RJC  RJ45-2x  [RJ45_dual_right]

### Nets
+5: C25.2 CAN.3(VDD)
GND: C25.1 CAN.2(VSS) R63.1 R70.2 RJC.4(C) RJC.5(C') RJC.12(C) RJC.13(C') RJC.SH  [project net 5GND]
CANH: CAN.7(CANH) R65.1 RJC.7(D) RJC.15(D)
CANL: CAN.6(CANL) R65.2 RJC.8(D') RJC.16(D')
CANRX: R68.2 R70.1
CANRXo: CAN.4(RXD) R68.1
CANTX: CAN.1(TXD)
D+: RJC.3(B) RJC.11(B)
D-: RJC.6(B') RJC.14(B')
NetCAN_8: CAN.8(RS) R63.2

Not connected (* = marked no-connect by the designer): CAN 5(VREF); RJC 1(A) 2(A') 9(A) 10(A')

### Library data of the parts
C25 = Cap: Capacitor; Published: 8-Jun-2000; LatestRevisionDate: 17-Jul-2002; LatestRevisionNote: Re-released for DXP Platform.; PackageReference: RAD-0.3; Publisher: Altium Limited; Value: 100nF
CAN = MCP2551-E_SN: Integrated Circuit; Manufacturer_Name: Microchip; Manufacturer_Part_Number: MCP2551-E/SN; Datasheet Link: https://datasheet.datasheetarchive.com/originals/distributors/SFDatasheet-4/sf-00090061.pdf; Height: 1.75mm; Mouser Part Number: 579-MCP2551-E/SN; Mouser Price/Stock: https://www.mouser.co.uk/ProductDetail/Microchip-Technology/MCP2551-E-SN?qs=Vn0zuzr35GHkGDCgnw0F9A%3D%3D; Arrow Part Number: MCP2551-E/SN; Arrow Price/Stock: https://www.arrow.com/en/products/mcp2551-esn/microchip-technology
R63 R65 R68 R70 = Res: Semiconductor Resistor; Published: 8-Jun-2000; LatestRevisionDate: 17-Jul-2002; LatestRevisionNote: Re-released for DXP Platform.; PackageReference: AXIAL-0.5; Publisher: Altium Limited
RJC = RJ45_dual_right: RJ45_Dual-Right

## Sheet gatedriver.SchDoc
size A4
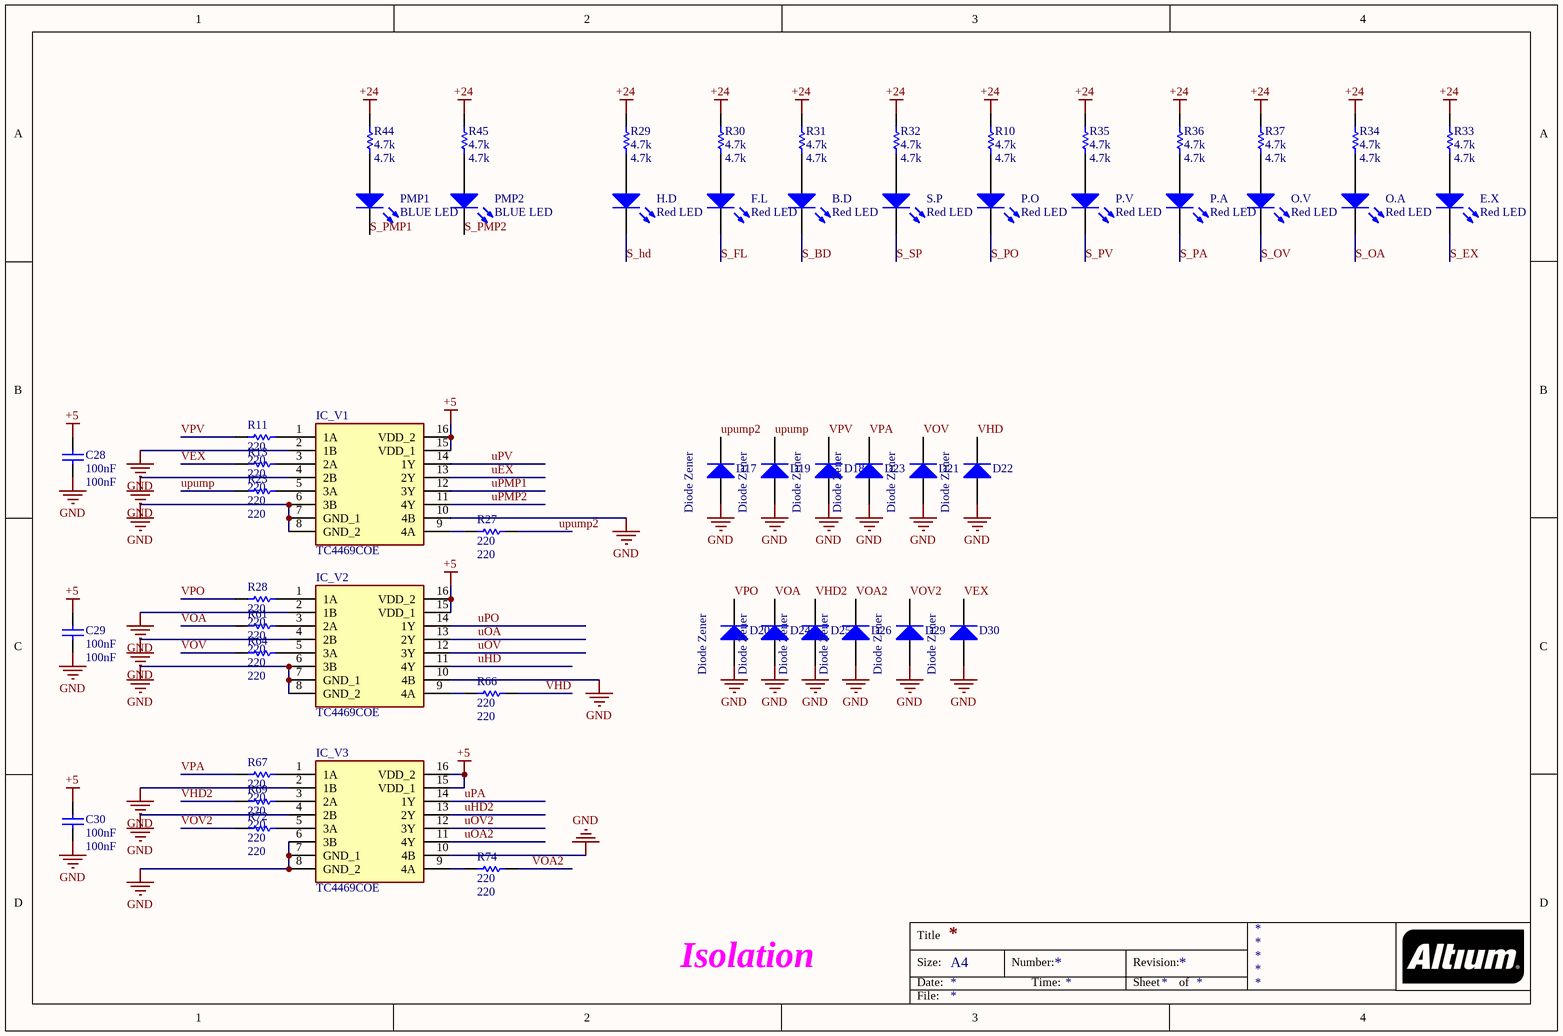
[diagram p5: gatedriver.SchDoc]

### Parts
B.D  Red LED  [3518]
C28  100nF  [0805]
C29  100nF  [0805]
C30  100nF  [0805]
D17  Diode Zener  [d1805]
D18  Diode Zener  [d1805]
D19  Diode Zener  [d1805]
D20  Diode Zener  [d1805]
D21  Diode Zener  [d1805]
D22  Diode Zener  [d1805]
D23  Diode Zener  [d1805]
D24  Diode Zener  [d1805]
D25  Diode Zener  [d1805]
D26  Diode Zener  [d1805]
D29  Diode Zener  [d1805]
D30  Diode Zener  [d1805]
E.X  Red LED  [3518]
F.L  Red LED  [3518]
H.D  Red LED  [3518]
IC_V1  TC4469COE  [SOIC127P1034X264-16N]
IC_V2  TC4469COE  [SOIC127P1034X264-16N]
IC_V3  TC4469COE  [SOIC127P1034X264-16N]
O.A  Red LED  [3518]
O.V  Red LED  [3518]
P.A  Red LED  [3518]
P.O  Red LED  [3518]
P.V  Red LED  [3518]
PMP1  BLUE LED  [3518]
PMP2  BLUE LED  [3518]
R10  4.7k  [0805]
R11  220  [0805]
R13  220  [0805]
R23  220  [0805]
R27  220  [0805]
R28  220  [0805]
R29  4.7k  [0805]
R30  4.7k  [0805]
R31  4.7k  [0805]
R32  4.7k  [0805]
R33  4.7k  [0805]
R34  4.7k  [0805]
R35  4.7k  [0805]
R36  4.7k  [0805]
R37  4.7k  [0805]
R44  4.7k  [0805]
R45  4.7k  [0805]
R61  220  [0805]
R64  220  [0805]
R66  220  [0805]
R67  220  [0805]
R69  220  [0805]
R72  220  [0805]
R74  220  [0805]
S.P  Red LED  [3518]

### Nets
+5: C28.2 C29.2 C30.2 IC_V1.15(VDD_1) IC_V1.16(VDD_2) IC_V2.15(VDD_1) IC_V2.16(VDD_2) IC_V3.15(VDD_1) IC_V3.16(VDD_2)
+24: R10.1 R29.1 R30.1 R31.1 R32.1 R33.1 R34.1 R35.1 R36.1 R37.1 R44.1 R45.1
GND: C28.1 C29.1 C30.1 D17.1(A) D18.1(A) D19.1(A) D20.1(A) D21.1(A) D22.1(A) D23.1(A) D24.1(A) D25.1(A) D26.1(A) D29.1(A) D30.1(A) IC_V1.2(1B) IC_V1.4(2B) IC_V1.6(3B) IC_V1.7(GND_1) IC_V1.8(GND_2) IC_V1.10(4B) IC_V2.2(1B) IC_V2.4(2B) IC_V2.6(3B) IC_V2.7(GND_1) IC_V2.8(GND_2) IC_V2.10(4B) IC_V3.2(1B) IC_V3.4(2B) IC_V3.6(3B) IC_V3.7(GND_1) IC_V3.8(GND_2) IC_V3.10(4B)  [project net 5GND]
S_bd: B.D.2(K)
S_EX: E.X.2(K)
S_fl: F.L.2(K)
S_hd: H.D.2(K)
S_OA: O.A.2(K)
S_OV: O.V.2(K)
S_Pa: P.A.2(K)
S_PMP1: PMP1.2(K)
S_PMP2: PMP2.2(K)
S_PO: P.O.2(K)
S_PV: P.V.2(K)
S_sp: S.P.2(K)
uEX: IC_V1.13(2Y)
uHD: IC_V2.11(4Y)
uHD2: IC_V3.13(2Y)
uOA: IC_V2.13(2Y)
uOA2: IC_V3.11(4Y)
uOV: IC_V2.12(3Y)
uOV2: IC_V3.12(3Y)
uPA: IC_V3.14(1Y)
uPMP1: IC_V1.12(3Y)
uPMP2: IC_V1.11(4Y)
uPO: IC_V2.14(1Y)
upump: D19.2(K) R23.2
upump2: D17.2(K) R27.2
uPV: IC_V1.14(1Y)
VEX: D30.2(K) R13.2
VHD: D22.2(K) R66.2
VHD2: D25.2(K) R69.2
VOA: D24.2(K) R61.2
VOA2: D26.2(K) R74.2
VOV: D21.2(K) R64.2
VOV2: D29.2(K) R72.2
VPA: D23.2(K) R67.1
VPO: D20.2(K) R28.1
VPV: D18.2(K) R11.1
NetB.D_1: B.D.1(A) R31.2
NetE.X_1: E.X.1(A) R33.2
NetF.L_1: F.L.1(A) R30.2
NetH.D_1: H.D.1(A) R29.2
NetIC_V1_1: IC_V1.1(1A) R11.2
NetIC_V1_3: IC_V1.3(2A) R13.1
NetIC_V1_5: IC_V1.5(3A) R23.1
NetIC_V1_9: IC_V1.9(4A) R27.1
NetIC_V2_1: IC_V2.1(1A) R28.2
NetIC_V2_3: IC_V2.3(2A) R61.1
NetIC_V2_5: IC_V2.5(3A) R64.1
NetIC_V2_9: IC_V2.9(4A) R66.1
NetIC_V3_1: IC_V3.1(1A) R67.2
NetIC_V3_3: IC_V3.3(2A) R69.1
NetIC_V3_5: IC_V3.5(3A) R72.1
NetIC_V3_9: IC_V3.9(4A) R74.1
NetO.A_1: O.A.1(A) R34.2
NetO.V_1: O.V.1(A) R37.2
NetP.A_1: P.A.1(A) R36.2
NetP.O_1: P.O.1(A) R10.2
NetP.V_1: P.V.1(A) R35.2
NetPMP1_1: PMP1.1(A) R44.2
NetPMP2_1: PMP2.1(A) R45.2
NetR32_2: R32.2 S.P.1(A)

### Notes on the sheet
- Isolation
- Title
- Size:
- Date:
- A4
- Number:
- Time:
- Revision:
- Sheet
- of
- File:

### Library data of the parts
B.D E.X F.L H.D O.A O.V P.A P.O P.V S.P = LED3: Typical BLUE SiC LED; pin to pad: 1>2 2>1; Published: 8-Jun-2000; LatestRevisionDate: 17-Dec-2003; LatestRevisionNote: PCB Footprint replaced.; DatasheetDocument: 16-Apr-2002; PackageDocument: 16-Apr-2002; PackageReference: 3.5X2.8X1.9; Publisher: Altium Limited
C28-C30 = Cap: as C27 on sheet accessories; Published: 08/06/2000; Publisher: Altium Hobart Technology Centre; SubClass: Capacitor; Value: 100nF
D17-D26 D29 D30 = Diode 1N914: High Conductance Fast Diode; Published: 8-Jun-2000; LatestRevisionDate: 17-Jul-2002; LatestRevisionNote: Re-released for DXP Platform.; DatasheetVersion: 1997; PackageReference: DO-35; Publisher: Altium Limited; PackageDescription: Diode, Axial; Body 3.8 x 1.9 mm (LxDia. max), Lead Dia. 0.53 mm (max); Code_JEDEC: DO-204-AH; ComponentLink1Description: Manufacturer Link; ComponentLink1URL: http://www.fairchildsemi.com/; ComponentLink2Description: Datasheet; ComponentLink2URL: http://www.fairchildsemi.com/ds/1N%2F1N4448.pdf
IC_V1-IC_V3 = TC4469COE: Integrated Circuit; Manufacturer_Name: Microchip; Datasheet Link: http://ww1.microchip.com/downloads/en/DeviceDoc/21425C.pdf; Height: 2.64mm; Manufacturer_Part_Number: TC4469COE; Mouser Part Number: 579-TC4469COE; Mouser Price/Stock: https://www.mouser.co.uk/ProductDetail/Microchip-Technology/TC4469COE?qs=InakTnyiSK%2Fh2FRrgfNERA%3D%3D; Arrow Part Number: TC4469COE; Arrow Price/Stock: https://www.arrow.com/en/products/tc4469coe/microchip-technology?region=nac
PMP1 PMP2 = LED3: pin to pad: 1>2 2>1; Published: 8-Jun-2000; LatestRevisionDate: 17-Dec-2003; LatestRevisionNote: PCB Footprint replaced.; DatasheetDocument: 16-Apr-2002; PackageDocument: 16-Apr-2002; PackageReference: 3.5X2.8X1.9; Publisher: Altium Limited
R10 R11 R13 R23 R27-R37 R44 R45 R61 R64 R66 R67 R69 R72 R74 = Res1: Resistor; Published: 8-Jun-2000; LatestRevisionDate: 17-Jul-2002; LatestRevisionNote: Re-released for DXP Platform.; PackageReference: AXIAL-0.3; Publisher: Altium Limited
  R10 R29-R37 R44 R45: Value: 4.7k
  R11 R13 R23 R27 R28 R61 R64 R66 R67 R69 R72 R74: Value: 220

## Nets that join several sheets
5GND: accessories (26 pins), Power (9 pins), microf4 (27 pins), CAN bus (9 pins), gatedriver (33 pins)
24GND: accessories (12 pins), Power (C8.1 D12.2 L1.2 PS24-5.3)
+3.3: accessories (8 pins), Power (FU1.2 R46.1), microf4 (22 pins)
+5: accessories (10 pins), Power (5 pins), CAN bus (C25.2 CAN.3), gatedriver (9 pins)
+24: accessories (24 pins), Power (D12.1 FU2.2), gatedriver (12 pins)
HT: accessories (R42.2), microf4 (U2.24)
HT2: accessories (R39.2), microf4 (U2.26)
PT: accessories (R62.2), microf4 (U2.25)
VT: accessories (R43.1), microf4 (U2.23)
ad0: accessories (Addr.1 R12.1), microf4 (U2.89)
ad1: accessories (Addr.2 R14.1), microf4 (U2.88)
ad2: accessories (Addr.3 R22.1), microf4 (U2.87)
CANRX: microf4 (U2.70), CAN bus (R68.2 R70.1)
CANTX: microf4 (U2.71), CAN bus (CAN.1)
D+: microf4 (D28.1 R58.2 R59.1 U3.6), CAN bus (RJC.3 RJC.11)
D-: microf4 (D28.2 R59.2 R60.1 U3.7), CAN bus (RJC.6 RJC.14)
S_bd: accessories (BD.1 D1.1 QBD.3), gatedriver (B.D.2)
S_EX: accessories (D6.1 EX.1 QEX.3), gatedriver (E.X.2)
S_fl: accessories (D2.1 FL.1 QFL.3), gatedriver (F.L.2)
S_hd: accessories (D8.1 HD.1 QHD.3), gatedriver (H.D.2)
S_OA: accessories (D10.1 OA.1 QOA.3), gatedriver (O.A.2)
S_OV: accessories (D7.1 OV.1 QOV.3), gatedriver (O.V.2)
S_Pa: accessories (D3.1 PA.1 QPA.3), gatedriver (P.A.2)
S_PMP1: accessories (D4.1 M_pmp1.2 Pump1.1), gatedriver (PMP1.2)
S_PMP2: accessories (D15.1 M_pmp2.2 Pump2.1), gatedriver (PMP2.2)
S_PO: accessories (D16.1 PO.1 QPO.3), gatedriver (P.O.2)
S_PV: accessories (D9.1 PV.1 QPV.3), gatedriver (P.V.2)
S_sp: accessories (D5.1 QSP.3 SP.1), gatedriver (S.P.2)
Testmode: accessories (Addr.4 R24.1), microf4 (U2.86)
uEX: accessories (R3.1), gatedriver (IC_V1.13)
uHD: accessories (R17.1), gatedriver (IC_V2.11)
uHD2: accessories (R2.1), gatedriver (IC_V3.13)
uOA: accessories (R19.1), gatedriver (IC_V2.13)
uOA2: accessories (R1.1), gatedriver (IC_V3.11)
uOV: accessories (R9.1), gatedriver (IC_V2.12)
uOV2: accessories (R7.1), gatedriver (IC_V3.12)
uPA: accessories (R8.1), gatedriver (IC_V3.14)
uPMP1: accessories (R5.1), gatedriver (IC_V1.12)
uPMP2: accessories (R6.1), gatedriver (IC_V1.11)
uPO: accessories (R4.1), gatedriver (IC_V2.14)
upump: microf4 (U2.59), gatedriver (D19.2 R23.2)
upump2: microf4 (U2.60), gatedriver (D17.2 R27.2)
uPV: accessories (R18.1), gatedriver (IC_V1.14)
VEX: microf4 (U2.58), gatedriver (D30.2 R13.2)
VHD: microf4 (U2.56), gatedriver (D22.2 R66.2)
VHD2: microf4 (U2.43), gatedriver (D25.2 R69.2)
VOA: microf4 (U2.54), gatedriver (D24.2 R61.2)
VOA2: microf4 (U2.45), gatedriver (D26.2 R74.2)
VOV: microf4 (U2.55), gatedriver (D21.2 R64.2)
VOV2: microf4 (U2.44), gatedriver (D29.2 R72.2)
VPA: microf4 (U2.42), gatedriver (D23.2 R67.1)
VPO: microf4 (U2.53), gatedriver (D20.2 R28.1)
VPV: microf4 (U2.57), gatedriver (D18.2 R11.1)